# Altium schematic sheet MAIN-FAN .SchDoc
size A4; SheetNumber: 24; SheetTotal: 32
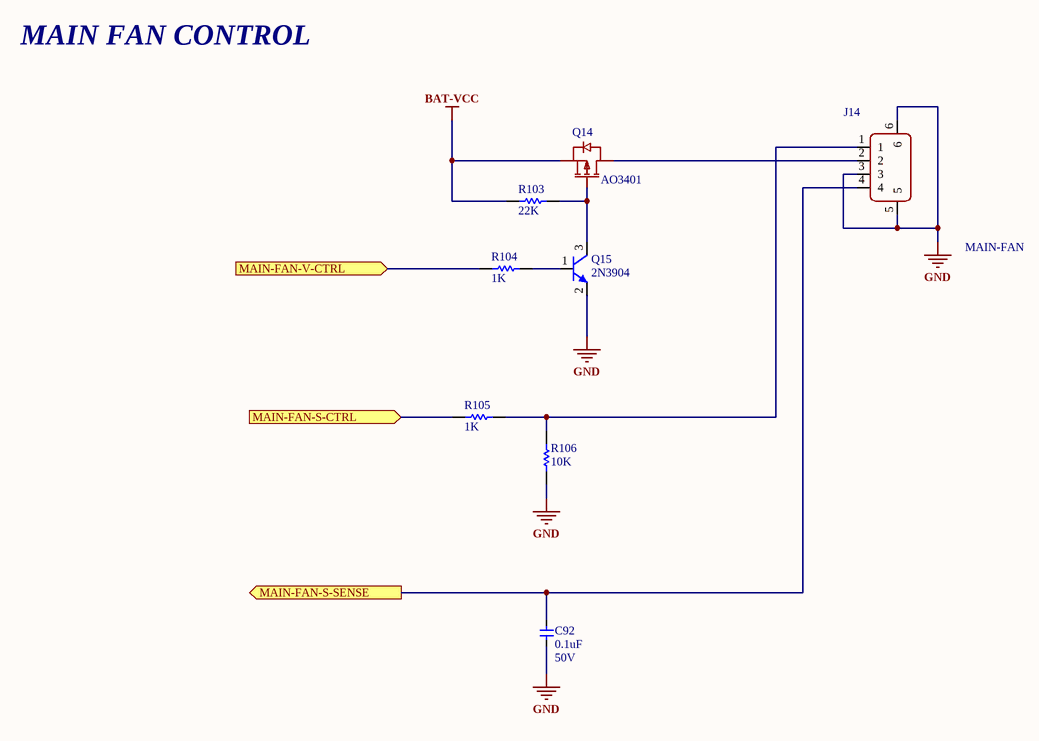
[diagram p0: MAIN-FAN .SchDoc]

## Parts
C92  0.1uF  VoltageRate: 50V  [CAP-0402]
J14  MAIN-FAN  [CONN-SMD_4P-P2.00_XUNPU_WAFER-PH2.0-4PWB]
Q14  AO3401  [SOT23-3D]
Q15  2N3904  [SOT23-3D]
R103  22K  [RES-0402]
R104  1K  [RES-0402]
R105  1K  [RES-0402]
R106  10K  [RES-0402]

## Ports
MAIN-FAN-S-CTRL (in, see Controller-RK3562-TOP[2C]), MAIN-FAN-S-SENSE (out, see Controller-RK3562-TOP[2C]), MAIN-FAN-V-CTRL (in, see Controller-RK3562-TOP[2C])

## Nets
BAT-VCC: Q14.2(S) R103.1
GND: C92.2 J14.3 J14.5 J14.6 Q15.2(E) R106.1
MAIN-FAN-S-CTRL: R105.2 ; port MAIN-FAN-S-CTRL
MAIN-FAN-S-SENSE: C92.1 J14.4 ; port MAIN-FAN-S-SENSE
MAIN-FAN-V-CTRL: R104.1 ; port MAIN-FAN-V-CTRL
NetJ14_1: J14.1 R105.1 R106.2
NetJ14_2: J14.2 Q14.3(D)
NetQ14_1: Q14.1(G) Q15.3(C) R103.2
NetQ15_1: Q15.1(B) R104.2

## Notes on the sheet
- MAIN FAN CONTROL

## Library data of the parts
C92 = Capacitor-1: ManufacturingPartNumber: *; Manufacturer: *; SupplierPartNumber: *; Supplier: *
J14 = HDRx4: ManufacturingPartNumber: *; Manufacturer: *; SupplierPartNumber: *; Supplier: *; VoltageRate: *
Q14 = P-MOS-SOT23: ManufacturingPartNumber: *; Manufacturer: *; SupplierPartNumber: *; Supplier: *; VoltageRate: *
Q15 = NPN-SOT23: ManufacturingPartNumber: *; Manufacturer: *; SupplierPartNumber: *; Supplier: *; VoltageRate: *
R103-R106 = Resistor-1: ManufacturingPartNumber: *; Manufacturer: *; SupplierPartNumber: *; Supplier: *; VoltageRate: *